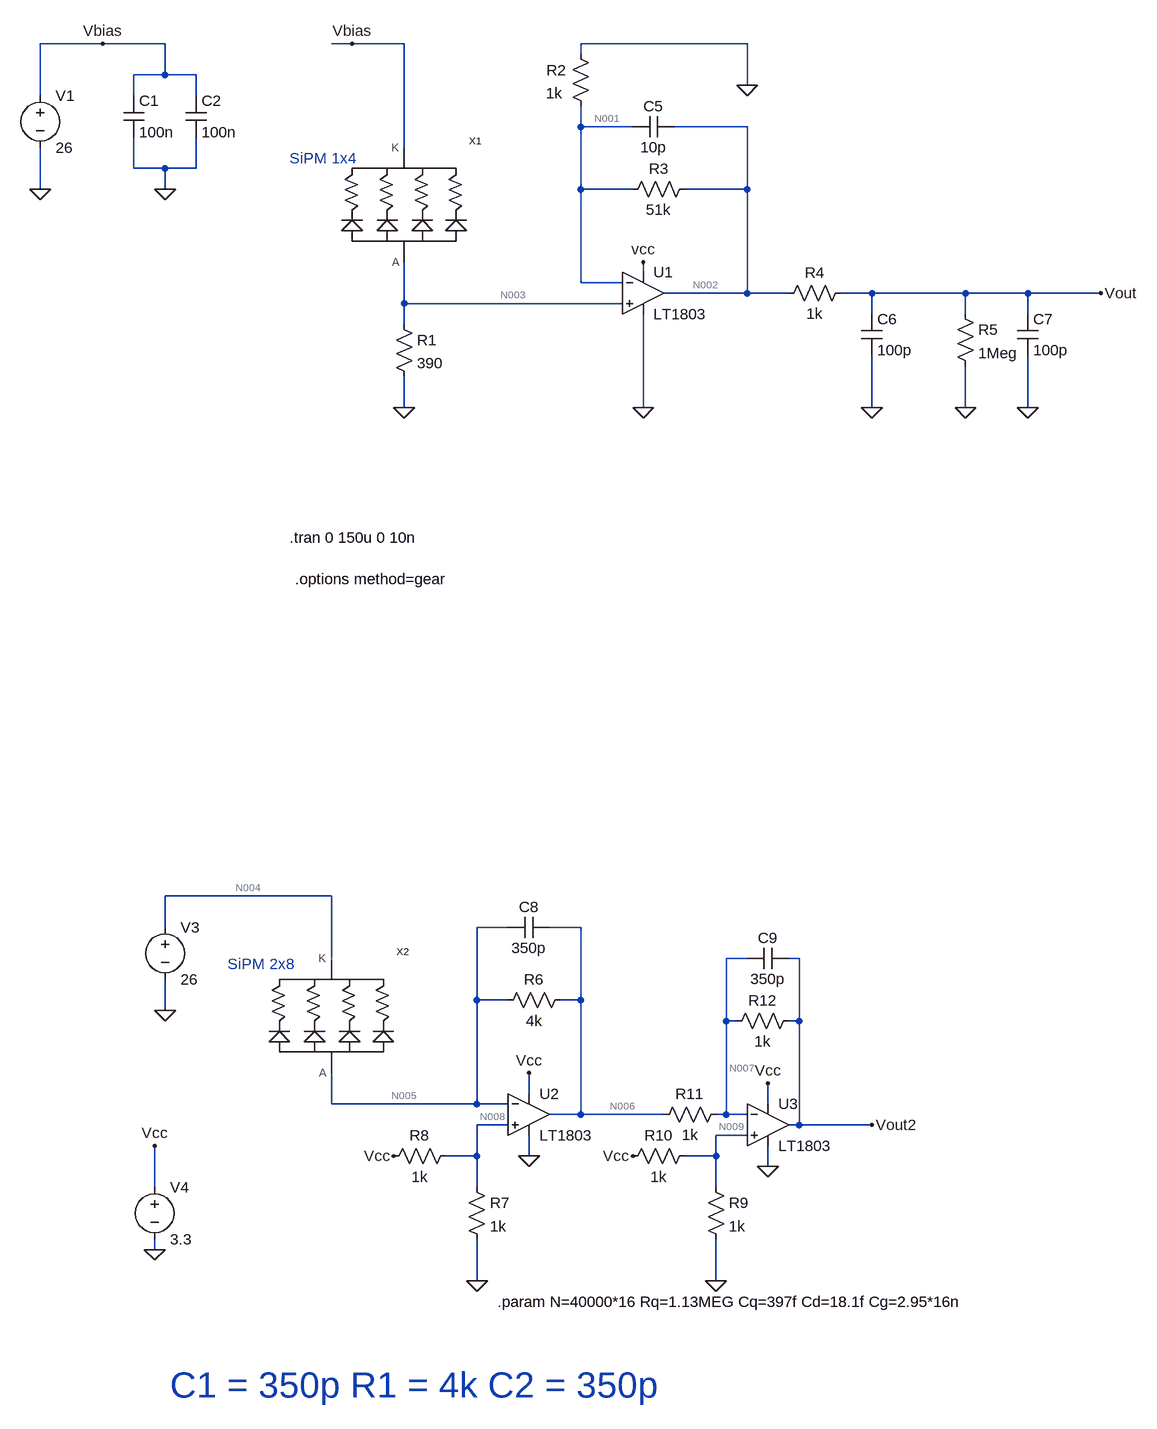
[diagram p0: schematic confronto.asc]
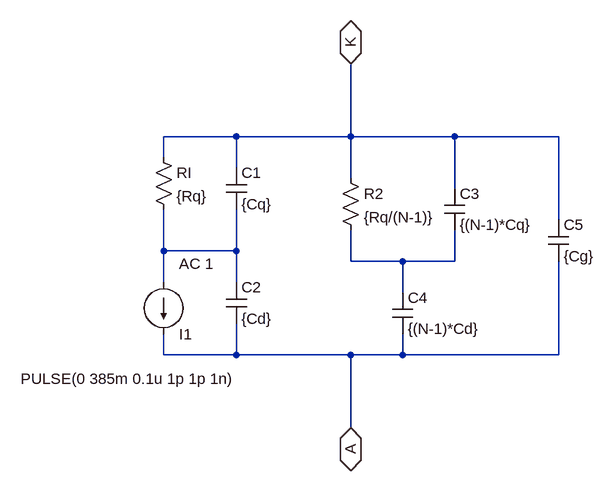
[diagram p1: sub-circuit sipm_equivalente_controllo_tensione_pulse.asc]
* confronto.asc
V1 Vbias 0 26
C1 Vbias 0 100n
R1 N003 0 390
R2 0 N001 1k
R3 N002 N001 51k
X§X1 Vbias N003 sipm_equivalente_controllo_tensione_pulse
C2 Vbias 0 100n
C5 N002 N001 10p
R4 Vout N002 1k
C6 Vout 0 100p
C7 Vout 0 100p
R5 Vout 0 1Meg
* U1: LT1803 (symbol OpAmps\LT1803 not available, pins judged from their places): In+=N003 In-=N001 V+=vcc V-=0 OUT=N002
V3 N004 0 26
V4 vcc 0 3.3
X§X2 N004 N005 sipm_equivalente_controllo_tensione_pulse
R6 N006 N005 4k
C8 N006 N005 350p
* U2: LT1803 (symbol OpAmps\LT1803 not available, pins judged from their places): In+=N008 In-=N005 V+=vcc V-=0 OUT=N006
R7 N008 0 1k
R8 N008 vcc 1k
* U3: LT1803 (symbol OpAmps\LT1803 not available, pins judged from their places): In+=N009 In-=N007 V+=vcc V-=0 OUT=Vout2
R9 N009 0 1k
R10 N009 vcc 1k
R11 N007 N006 1k
R12 Vout2 N007 1k
C9 Vout2 N007 350p

* block symbol definitions
.subckt sipm_equivalente_controllo_tensione_pulse K A
RI K N001 {Rq}
R2 K N002 {Rq/(N-1)}
C1 K N001 {Cq}
C2 N001 A {Cd}
C3 K N002 {(N-1)*Cq}
C4 N002 A {(N-1)*Cd}
C5 K A {Cg}
I1 N001 A PULSE(0 385m 0.1u 1p 1p 1n) AC 1
.ends sipm_equivalente_controllo_tensione_pulse

.tran 0 150u 0 10n
* SiPM 1x4
.param N=40000*16 Rq=1.13MEG Cq=397f Cd=18.1f Cg=2.95*16n
* C1 = 350p R1 = 4k C2 = 350p
* SiPM 2x8
.options method=gear
.backanno
.end

* Results of the author's LTspice run, read from the files saved beside the schematic
* Operating Point, zero values left out:
*   V(n001) = 143.5 µV
*   V(n002) = 126.1 mV
*   V(n003) = -945.9 µV
*   V(n004) = 26 V
*   V(n005) = 1.65 V
*   V(n006) = 1.659 V
*   V(n007) = 1.65 V
*   V(n008) = 1.649 V
*   V(n009) = 1.649 V
*   V(vbias) = 26 V
*   V(vcc) = 3.3 V
*   V(vout) = 125.9 mV
*   V(vout2) = 1.643 V
*   I(R1) = -2.425 µA
*   I(R10) = -1.651 mA
*   I(R11) = -9.301 µA
*   I(R12) = -6.976 µA
*   I(R2) = -143.5 nA
*   I(R3) = 2.469 µA
*   I(R4) = -125.9 nA
*   I(R5) = 125.9 nA
*   I(R6) = 2.325 µA
*   I(R7) = 1.649 mA
*   I(R8) = -1.651 mA
*   I(R9) = 1.649 mA
*   I(V4) = -12 mA
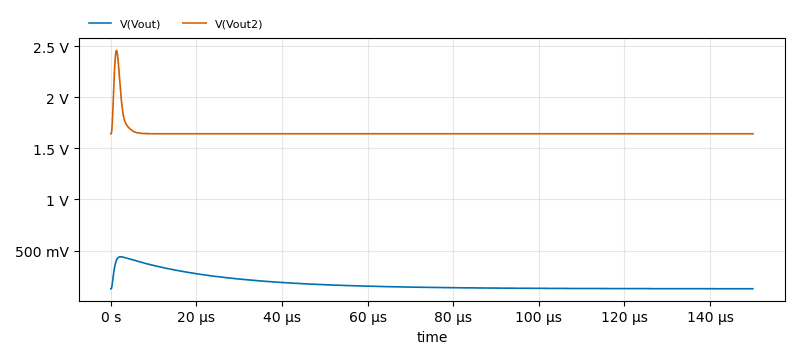
[diagram p2: Transient Analysis of confronto.asc, plotted from the saved traces]
* Transient Analysis, 1 run:
*   V(Vout): min 125.9 mV, max 439.4 mV, average 177.8 mV, rms 193.8 mV, last 126.3 mV
*   V(Vout2): min 1.641 V, max 2.459 V, average 1.653 V, rms 1.655 V, last 1.643 V